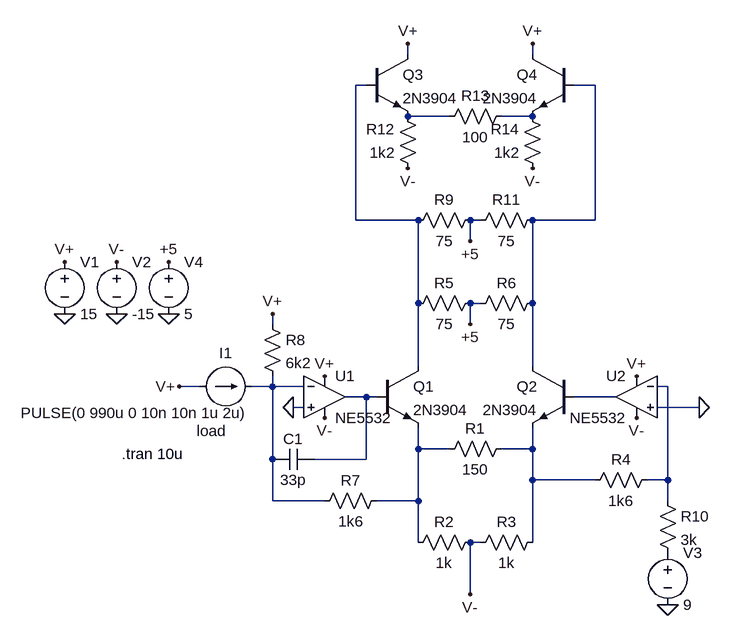
[diagram p0: schematic analog_line_txrx.asc]
analog_line_txrx.asc, the LTspice schematic file:
Version 4
SHEET 1 996 856
WIRE 448 -272 448 -288
WIRE 640 -272 640 -288
WIRE 384 -224 368 -224
WIRE 736 -224 704 -224
WIRE 512 -176 448 -176
WIRE 640 -176 592 -176
WIRE 368 -16 368 -224
WIRE 464 -16 368 -16
WIRE 560 -16 544 -16
WIRE 736 -16 736 -224
WIRE 736 -16 640 -16
WIRE 544 16 544 -16
WIRE 464 112 464 -16
WIRE 560 112 544 112
WIRE 640 112 640 -16
WIRE 240 144 240 128
WIRE 544 144 544 112
WIRE 464 208 464 112
WIRE 640 208 640 112
WIRE 128 240 96 240
WIRE 240 240 240 224
WIRE 240 240 208 240
WIRE 288 240 240 240
WIRE 848 240 832 240
WIRE 384 256 352 256
WIRE 400 256 384 256
WIRE 768 256 704 256
WIRE 288 272 272 272
WIRE 896 272 832 272
WIRE 464 336 464 304
WIRE 512 336 464 336
WIRE 640 336 640 304
WIRE 640 336 592 336
WIRE 240 352 240 240
WIRE 384 352 384 256
WIRE 384 352 304 352
WIRE 640 384 640 336
WIRE 736 384 640 384
WIRE 848 384 848 240
WIRE 848 384 816 384
WIRE 240 416 240 352
WIRE 320 416 240 416
WIRE 464 416 464 336
WIRE 464 416 400 416
WIRE 848 416 848 384
WIRE 464 480 464 416
WIRE 560 480 544 480
WIRE 640 480 640 384
WIRE 544 560 544 480
FLAG -80 128 0
FLAG -80 48 V+
FLAG 0 128 0
FLAG 0 48 V-
FLAG 320 224 V+
FLAG 320 288 V-
FLAG 800 224 V+
FLAG 800 288 V-
FLAG 272 272 0
FLAG 240 128 V+
FLAG 96 240 V+
FLAG 896 272 0
FLAG 544 560 V-
FLAG 848 576 0
FLAG 80 128 0
FLAG 80 48 +5
FLAG 544 144 +5
FLAG 544 16 +5
FLAG 448 -288 V+
FLAG 640 -288 V+
FLAG 448 -96 V-
FLAG 640 -96 V-
SYMBOL voltage -80 32 R0
WINDOW 123 0 0 Left 2
WINDOW 39 0 0 Left 2
SYMATTR InstName V1
SYMATTR Value 15
SYMBOL voltage 0 32 R0
WINDOW 123 0 0 Left 2
WINDOW 39 0 0 Left 2
SYMATTR InstName V2
SYMATTR Value -15
SYMBOL Opamps\\TI\\NE5532 320 256 R0
SYMATTR InstName U1
SYMBOL Opamps\\TI\\NE5532 800 256 M0
SYMATTR InstName U2
SYMBOL npn 400 208 R0
SYMATTR InstName Q1
SYMATTR Value 2N3904
SYMBOL npn 704 208 M0
SYMATTR InstName Q2
SYMATTR Value 2N3904
SYMBOL res 608 320 R90
WINDOW 0 0 56 VBottom 2
WINDOW 3 32 56 VTop 2
SYMATTR InstName R1
SYMATTR Value 150
SYMBOL res 560 464 R90
WINDOW 0 0 56 VBottom 2
WINDOW 3 32 56 VTop 2
SYMATTR InstName R2
SYMATTR Value 1k
SYMBOL res 656 464 R90
WINDOW 0 0 56 VBottom 2
WINDOW 3 32 56 VTop 2
SYMATTR InstName R3
SYMATTR Value 1k
SYMBOL res 416 400 R90
WINDOW 0 0 56 VBottom 2
WINDOW 3 32 56 VTop 2
SYMATTR InstName R7
SYMATTR Value 1k6
SYMBOL load2 128 240 R270
WINDOW 0 36 40 VTop 2
WINDOW 3 -25 -100 VBottom 2
WINDOW 123 0 0 Left 2
WINDOW 39 -53 18 VBottom 2
SYMATTR InstName I1
SYMATTR Value PULSE(0 990u 0 10n 10n 1u 2u)
SYMATTR SpiceLine load
SYMBOL res 224 128 R0
SYMATTR InstName R8
SYMATTR Value 6k2
SYMBOL cap 304 336 R90
WINDOW 0 0 32 VBottom 2
WINDOW 3 32 32 VTop 2
SYMATTR InstName C1
SYMATTR Value 33p
SYMBOL res 832 400 R0
SYMATTR InstName R10
SYMATTR Value 3k
SYMBOL res 832 368 R90
WINDOW 0 0 56 VBottom 2
WINDOW 3 32 56 VTop 2
SYMATTR InstName R4
SYMATTR Value 1k6
SYMBOL voltage 848 480 R0
WINDOW 123 0 0 Left 2
WINDOW 39 0 0 Left 2
SYMATTR InstName V3
SYMATTR Value 9
SYMBOL res 560 96 R90
WINDOW 0 0 56 VBottom 2
WINDOW 3 32 56 VTop 2
SYMATTR InstName R5
SYMATTR Value 75
SYMBOL res 656 96 R90
WINDOW 0 0 56 VBottom 2
WINDOW 3 32 56 VTop 2
SYMATTR InstName R6
SYMATTR Value 75
SYMBOL voltage 80 32 R0
WINDOW 123 0 0 Left 2
WINDOW 39 0 0 Left 2
SYMATTR InstName V4
SYMATTR Value 5
SYMBOL npn 384 -272 R0
SYMATTR InstName Q3
SYMATTR Value 2N3904
SYMBOL npn 704 -272 M0
SYMATTR InstName Q4
SYMATTR Value 2N3904
SYMBOL res 560 -32 R90
WINDOW 0 0 56 VBottom 2
WINDOW 3 32 56 VTop 2
SYMATTR InstName R9
SYMATTR Value 75
SYMBOL res 656 -32 R90
WINDOW 0 0 56 VBottom 2
WINDOW 3 32 56 VTop 2
SYMATTR InstName R11
SYMATTR Value 75
SYMBOL res 464 -80 R180
WINDOW 0 36 76 Left 2
WINDOW 3 36 40 Left 2
SYMATTR InstName R12
SYMATTR Value 1k2
SYMBOL res 608 -192 R90
WINDOW 0 0 56 VBottom 2
WINDOW 3 32 56 VTop 2
SYMATTR InstName R13
SYMATTR Value 100
SYMBOL res 656 -80 R180
WINDOW 0 36 76 Left 2
WINDOW 3 36 40 Left 2
SYMATTR InstName R14
SYMATTR Value 1k2
TEXT 8 344 Left 2 !.tran 10u

The netlist it stands for:
* analog_line_txrx.asc
V1 V+ 0 15
V2 V- 0 -15
XU1 0 N005 V+ V- N007 NE5532  ; pins In+ In- V+ V- OUT
XU2 0 N006 V+ V- N008 NE5532  ; pins In+ In- V+ V- OUT
Q1 N001 N007 N009 0 2N3904
Q2 N002 N008 N010 0 2N3904
R1 N010 N009 150
R2 V- N009 1k
R3 N010 V- 1k
R7 N009 N005 1k6
I1 V+ N005 PULSE(0 990u 0 10n 10n 1u 2u) load
R8 V+ N005 6k2
C1 N007 N005 33p
R10 N006 P001 3k
R4 N006 N010 1k6
V3 P001 0 9
R5 +5 N001 75
R6 N002 +5 75
V4 +5 0 5
Q3 V+ N001 N003 0 2N3904
Q4 V+ N002 N004 0 2N3904
R9 +5 N001 75
R11 N002 +5 75
R12 V- N003 1k2
R13 N004 N003 100
R14 V- N004 1k2
.model NPN NPN
.model PNP PNP
.lib standard.bjt
.tran 10u
.backanno
.end